# EAGLE schematic board generic (EAGLE 9.3.0)

## Sheet 1 of 3: Shield Connectors
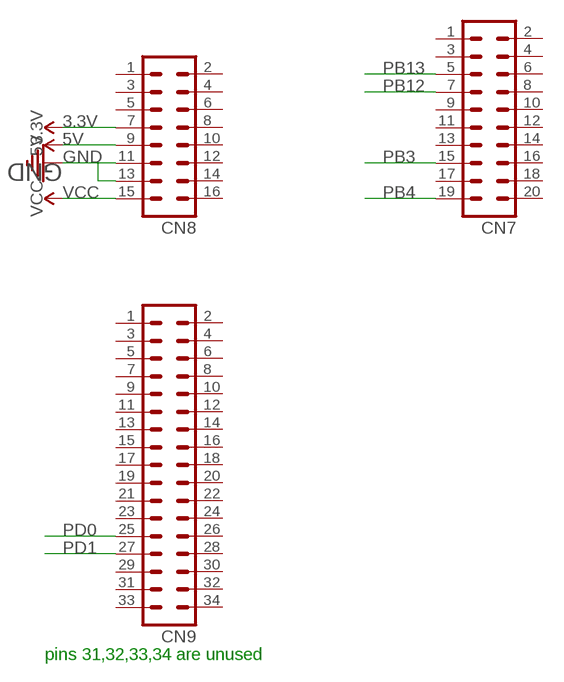
[diagram p0: schematic, sheet 1]

### Parts
CN7  MA10-2  [MA10-2]
CN8  MA08-2  [MA08-2]
CN9  MA17-2  [MA17-2]
GND1  GND  (no package)

### Nets
3.3V: CN8.7
5V: CN8.9 ; also sheet 2
GND: CN8.11 CN8.13 GND1.GND ; also sheet 2,3
PB3: CN7.15 ; also sheet 2
PB4: CN7.19 ; also sheet 2
PB12: CN7.7 ; also sheet 2
PB13: CN7.5 ; also sheet 2
PD0: CN9.25 ; also sheet 2
PD1: CN9.27 ; also sheet 2
VCC: CN8.15 ; also sheet 3
Unconnected: CN7.1 CN7.2 CN7.3 CN7.4 CN7.6 CN7.8 CN7.9 CN7.10 CN7.11 CN7.12 CN7.13 CN7.14 CN7.16 CN7.17 CN7.18 CN7.20 CN8.1 CN8.2 CN8.3 CN8.4 CN8.5 CN8.6 CN8.8 CN8.10 CN8.12 CN8.14 CN8.16 CN9.1 CN9.2 CN9.3 CN9.4 CN9.5 CN9.6 CN9.7 CN9.8 CN9.9 CN9.10 CN9.11 CN9.12 CN9.13 CN9.14 CN9.15 CN9.16 CN9.17 CN9.18 CN9.19 CN9.20 CN9.21 CN9.22 CN9.23 CN9.24 CN9.26 CN9.28 CN9.29 CN9.30 CN9.31 CN9.32 CN9.33 CN9.34

### Notes on the sheet
- pins 31,32,33,34 are unused

## Sheet 2 of 3: CAN
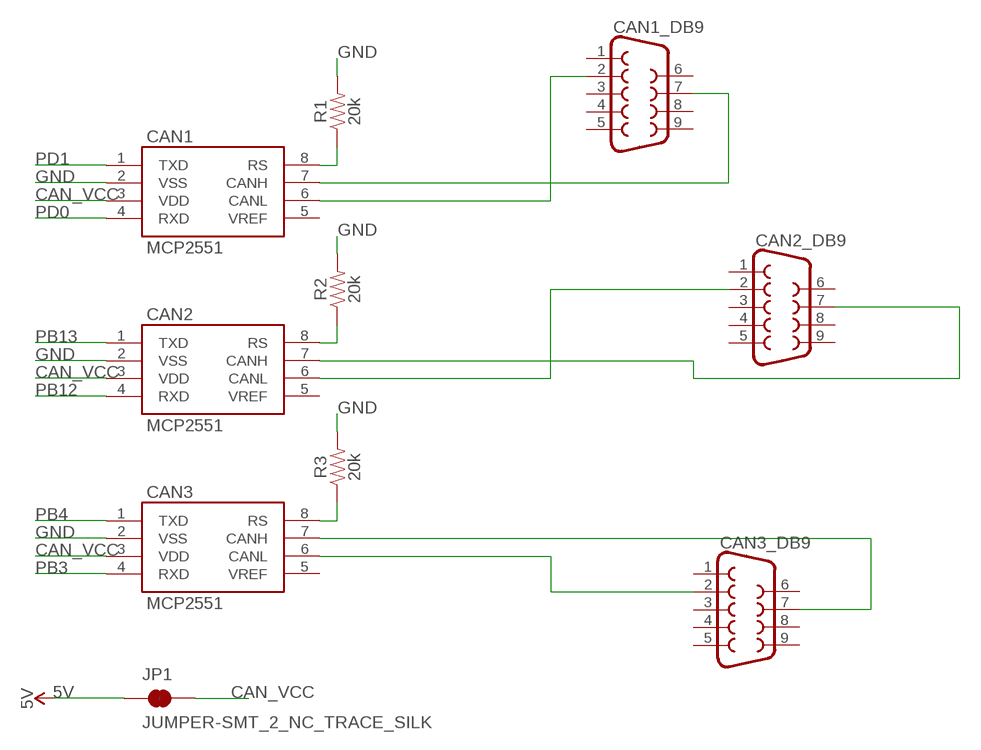
[diagram p1: schematic, sheet 2]

### Parts
CAN1  MCP2551  [SO08]
CAN1_DB9  DB9FEMALE  [DB9]
CAN2  MCP2551  [SO08]
CAN2_DB9  DB9FEMALE  [DB9]
CAN3  MCP2551  [SO08]
CAN3_DB9  DB9FEMALE  [DB9]
JP1  JUMPER-SMT_2_NC_TRACE_SILK  [SMT-JUMPER_2_NC_TRACE_SILK]
R1  20k  20KOHM-0603-1/10W-1%  [0603]
R2  20k  20KOHM-0603-1/10W-1%  [0603]
R3  20k  20KOHM-0603-1/10W-1%  [0603]

### Nets
5V: JP1.1 ; also sheet 1
CAN_VCC: CAN1.3(VDD) CAN2.3(VDD) CAN3.3(VDD) JP1.2
GND: CAN1.2(VSS) CAN2.2(VSS) CAN3.2(VSS) R1.2 R2.2 R3.2 ; also sheet 1,3
N$1: CAN1.7(CANH) CAN1_DB9.7
N$2: CAN1.6(CANL) CAN1_DB9.2
N$3: CAN2.6(CANL) CAN2_DB9.2
N$4: CAN3.6(CANL) CAN3_DB9.2
N$5: CAN3.7(CANH) CAN3_DB9.7
N$6: CAN2.7(CANH) CAN2_DB9.7
N$7: CAN1.8(RS) R1.1
N$8: CAN2.8(RS) R2.1
N$9: CAN3.8(RS) R3.1
PB3: CAN3.4(RXD) ; also sheet 1
PB4: CAN3.1(TXD) ; also sheet 1
PB12: CAN2.4(RXD) ; also sheet 1
PB13: CAN2.1(TXD) ; also sheet 1
PD0: CAN1.4(RXD) ; also sheet 1
PD1: CAN1.1(TXD) ; also sheet 1
Unconnected: CAN1.5(VREF) CAN1_DB9.1 CAN1_DB9.3 CAN1_DB9.4 CAN1_DB9.5 CAN1_DB9.6 CAN1_DB9.8 CAN1_DB9.9 CAN2.5(VREF) CAN2_DB9.1 CAN2_DB9.3 CAN2_DB9.4 CAN2_DB9.5 CAN2_DB9.6 CAN2_DB9.8 CAN2_DB9.9 CAN3.5(VREF) CAN3_DB9.1 CAN3_DB9.3 CAN3_DB9.4 CAN3_DB9.5 CAN3_DB9.6 CAN3_DB9.8 CAN3_DB9.9

## Sheet 3 of 3: Power
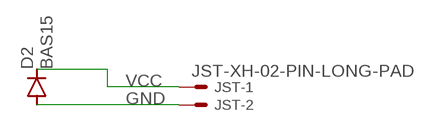
[diagram p2: schematic, sheet 3]

### Parts
D2  BAS15  [DO34-7]
JST  JST-XH-02-PIN-LONG-PAD  [JST-XH-02-PACKAGE-LONG-PAD]

### Nets
GND: D2.A JST.2 ; also sheet 1,2
VCC: D2.C JST.1 ; also sheet 1

## Library data of the parts
CAN1-CAN3 = SparkFun-IC-Comms:MCP2551: MCP2551 High Speed CAN Transceiver High speed CAN transceiver Datasheet <http://www.sparkfun.com/datasheets/DevTools/Arduino/MCP2551.pdf> SparkFun Products CAN-BUS Shield <https://www.sparkfun.com/products/13262> (DEV-13262) SparkFun OBD-II UART <https://www.sparkfun.com/products/9555> (WIG-09555); PROD_ID: IC-09907
CAN1_DB9 CAN2_DB9 CAN3_DB9 = SparkFun-Connectors:DB9: DB9 Connector Standard DB9 (D-Sub 9) serial connector. Can be used for CAN bus as well as RS485 and RS232. Footprint production proven. Here is the female version connector we sell at SparkFun: 9 Pin Female Serial Connector - PCB Mount <https://www.sparkfun.com/products/429> (PRT-00429) This connector has been used on the following SparkFun products: SparkFun RS232 Shifter - SMD <https://www.sparkfun.com/products/449> (PRT-00449) SparkFun RS232 Shifter SMD (No DB9) <https://www.sparkfun.com/products/8780> (PRT-08780); PROD_ID: CONN-08194
CN7 = con-lstb:MA10-2: PIN HEADER; OC_FARNELL: unknown; OC_NEWARK: unknown
CN8 = con-lstb:MA08-2: PIN HEADER; OC_FARNELL: unknown; OC_NEWARK: unknown
CN9 = con-lstb:MA17-2: PIN HEADER; OC_FARNELL: unknown; OC_NEWARK: unknown
D2 = diode:BAS15: DIODE high speed
GND1 = Connectors:GND
JP1 = SparkFun-Jumpers:JUMPER-SMT_2_NC_TRACE: Normally closed trace jumper This jumper has a trace between two pads so it's normally closed (NC). Use a razor knife to open the connection. For best results follow the IPC guidelines for cutting traces: Cutout at least 0.063 mm (0.005 in). Remove all loose material to clean up the cut area. Seal the cut with an approved epoxy. Reapply solder to reclose the connection.
JST = Rembrandt Electronics - JST XH Connectors v1-0:JST-XH-02-PIN: JST XH Connector 2 Pin Wire to board connector. Pitch: 2,54 mm, (0.100") Number of pins: 2 Created by Rembrandt Electronics www.rembrandtelectronics.com
R1-R3 = SparkFun-Resistors:20KOHM: 20kΩ resistor A resistor is a passive two-terminal electrical component that implements electrical resistance as a circuit element. Resistors act to reduce current flow, and, at the same time, act to lower voltage levels within circuits. - Wikipedia; PROD_ID: RES-09383